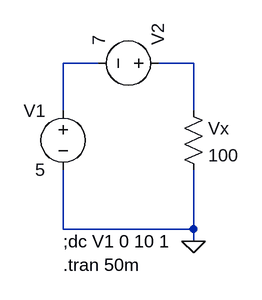
[diagram p0: schematic 1.asc]
1.asc, the LTspice schematic file:
Version 4
SHEET 1 880 680
WIRE 80 80 32 80
WIRE 208 80 160 80
WIRE 32 144 32 80
WIRE 208 144 208 80
WIRE 32 304 32 224
WIRE 208 304 208 224
WIRE 208 304 32 304
WIRE 208 320 208 304
FLAG 208 320 0
SYMBOL voltage 32 128 M0
WINDOW 123 0 0 Left 2
WINDOW 39 0 0 Left 2
SYMATTR InstName V1
SYMATTR Value 5
SYMBOL res 192 128 R0
SYMATTR InstName Vx
SYMATTR Value 100
SYMBOL voltage 176 80 M270
WINDOW 123 0 0 Left 2
WINDOW 39 0 0 Left 2
SYMATTR InstName V2
SYMATTR Value 7
TEXT 32 320 Left 2 !;dc V1 0 10 1
TEXT 32 352 Left 2 !.tran 50m

The netlist it stands for:
* 1.asc
V1 N001 0 5
R§Vx N002 0 100
V2 N002 N001 7
;dc V1 0 10 1
.tran 50m
.backanno
.end